# Altium schematic sheet Calculator.SchDoc
size 457 x 342 mm
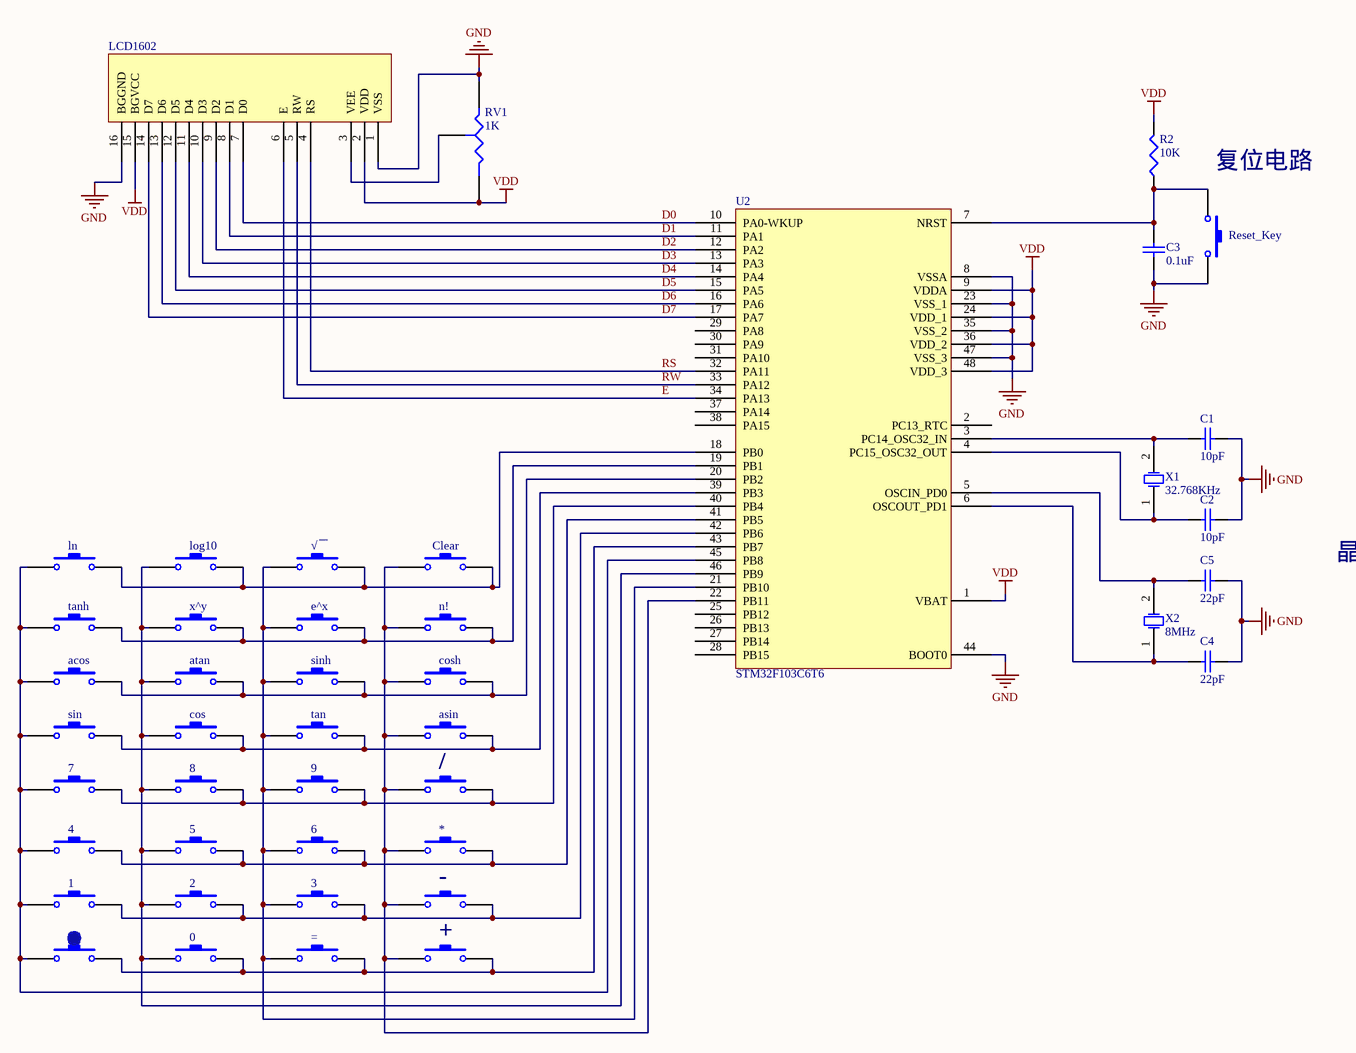
[diagram p0: Calculator.SchDoc]

## Parts
0  SW-PB  [SPST-2]  (value not drawn)
1  SW-PB  [SPST-2]  (value not drawn)
2  SW-PB  [SPST-2]  (value not drawn)
3  SW-PB  [SPST-2]  (value not drawn)
4  SW-PB  [SPST-2]  (value not drawn)
5  SW-PB  [SPST-2]  (value not drawn)
6  SW-PB  [SPST-2]  (value not drawn)
7  SW-PB  [SPST-2]  (value not drawn)
8  SW-PB  [SPST-2]  (value not drawn)
9  SW-PB  [SPST-2]  (value not drawn)
*  SW-PB  [SPST-2]  (value not drawn)
+  SW-PB  [SPST-2]  (value not drawn)
-  SW-PB  [SPST-2]  (value not drawn)
/  SW-PB  [SPST-2]  (value not drawn)
=  SW-PB  [SPST-2]  (value not drawn)
?  SW-PB  [SPST-2]  (value not drawn)
acos  SW-PB  [SPST-2]  (value not drawn)
asin  SW-PB  [SPST-2]  (value not drawn)
atan  SW-PB  [SPST-2]  (value not drawn)
C1  10pF  [RAD-0.3]
C2  10pF  [RAD-0.3]
C3  0.1uF  [RAD-0.3]
C4  22pF  [RAD-0.3]
C5  22pF  [RAD-0.3]
Clear  SW-PB  [SPST-2]  (value not drawn)
cos  SW-PB  [SPST-2]  (value not drawn)
cosh  SW-PB  [SPST-2]  (value not drawn)
e^x  SW-PB  [SPST-2]  (value not drawn)
LCD1602  LCD1602  (value not drawn)
ln  SW-PB  [SPST-2]  (value not drawn)
log10  SW-PB  [SPST-2]  (value not drawn)
n!  SW-PB  [SPST-2]  (value not drawn)
R2  10K  [12Z-2010]
Reset_Key  SW-PB  [SPST-2]  (value not drawn)
RV1  1K  [VR3]
sin  SW-PB  [SPST-2]  (value not drawn)
sinh  SW-PB  [SPST-2]  (value not drawn)
tan  SW-PB  [SPST-2]  (value not drawn)
tanh  SW-PB  [SPST-2]  (value not drawn)
U2  STM32F103C6T6
X1  32.768KHz  [R38]
X2  8MHz  [R38]
x^y  SW-PB  [SPST-2]  (value not drawn)
√￣  SW-PB  [SPST-2]  (value not drawn)

## Nets
GND: C1.1 C2.1 C3.1 C4.1 C5.1 LCD1602.1(VSS) LCD1602.16(BGGND) Reset_Key.2 RV1.1(A) U2.8(VSSA) U2.23(VSS_1) U2.35(VSS_2) U2.44(BOOT0) U2.47(VSS_3)
VDD: LCD1602.2(VDD) LCD1602.15(BGVCC) R2.2 RV1.2(B) U2.1(VBAT) U2.9(VDDA) U2.24(VDD_1) U2.36(VDD_2) U2.48(VDD_3)
D0: LCD1602.7(D0) U2.10(PA0-WKUP)
D1: LCD1602.8(D1) U2.11(PA1)
D2: LCD1602.9(D2) U2.12(PA2)
D3: LCD1602.10(D3) U2.13(PA3)
D4: LCD1602.11(D4) U2.14(PA4)
D5: LCD1602.12(D5) U2.15(PA5)
D6: LCD1602.13(D6) U2.16(PA6)
D7: LCD1602.14(D7) U2.17(PA7)
E: LCD1602.6(E) U2.34(PA13)
RS: LCD1602.4(RS) U2.32(PA11)
RW: LCD1602.5(RW) U2.33(PA12)
Net0_1: 0.1 2.1 5.1 8.1 atan.1 cos.1 log10.1 U2.46(PB9) x^y.1
Net0_2: 0.2 +.2 =.2 ?.2 U2.43(PB7)
Net1_1: 1.1 4.1 7.1 ?.1 acos.1 ln.1 sin.1 tanh.1 U2.45(PB8)
Net1_2: 1.2 2.2 3.2 -.2 U2.42(PB6)
Net3_1: 3.1 6.1 9.1 =.1 e^x.1 sinh.1 tan.1 U2.21(PB10) √￣.1
Net4_2: 4.2 5.2 6.2 *.2 U2.41(PB5)
Net7_2: 7.2 8.2 9.2 /.2 U2.40(PB4)
Net*_1: *.1 +.1 -.1 /.1 asin.1 Clear.1 cosh.1 n!.1 U2.22(PB11)
Netacos_2: acos.2 atan.2 cosh.2 sinh.2 U2.20(PB2)
Netasin_2: asin.2 cos.2 sin.2 tan.2 U2.39(PB3)
NetC1_2: C1.2 U2.3(PC14_OSC32_IN) X1.2(OSC2)
NetC2_2: C2.2 U2.4(PC15_OSC32_OUT) X1.1(OSC1)
NetC3_2: C3.2 R2.1 Reset_Key.1 U2.7(NRST)
NetC4_2: C4.2 U2.6(OSCOUT_PD1) X2.1(OSC1)
NetC5_2: C5.2 U2.5(OSCIN_PD0) X2.2(OSC2)
NetClear_2: Clear.2 ln.2 log10.2 U2.18(PB0) √￣.2
Nete^x_2: e^x.2 n!.2 tanh.2 U2.19(PB1) x^y.2
NetLCD1602_3: LCD1602.3(VEE) RV1.3(TAP)

Not connected (* = marked no-connect by the designer): U2 2(PC13_RTC) 25(PB12) 26(PB13) 27(PB14) 28(PB15) 29(PA8) 30(PA9) 31(PA10) 37(PA14) 38(PA15)

## Notes on the sheet
- 复位电路
- 晶振电路
- 项目名称：
- 文件名称：
- 淘宝搜索店铺：字节智控
- 字节智控
- 设计人：
- 核对人：
- 日期：
- 批准：
- 版本：
- 第
- 页
- 共
- 淘宝店铺：字节智控
- https://zijiezhikong.taobao.com

## Library data of the parts
0-9 * + - / = ? acos asin atan Clear cos cosh e^x ln log10 n! Reset_Key sin sinh tan tanh x^y √￣ = SW-PB: Switch; Published: 24-Mar-1999; LatestRevisionDate: 17-Jul-2002; LatestRevisionNote: Re-released for DXP Platform.; PackageReference: SPST-2; Publisher: Altium Limited; PackageDescription: Switch; 2 Leads
C1-C5 = Cap: Capacitor; Value: 100pF; Published: 8-Jun-2000; LatestRevisionDate: 17-Jul-2002; LatestRevisionNote: Re-released for DXP Platform.; PackageReference: RAD-0.3; Publisher: Altium Limited; PackageDescription: Radial Cap, Thru-Hole; 2 Leads; 0.3 in Pin Spacing
R2 = Res3: Resistor; Value: 1K; Published: 8-Jun-2000; LatestRevisionDate: 29-May-2009; LatestRevisionNote: IPC-7351 Footprint Added.; PackageReference: J1-0603; Publisher: Altium Limited; PackageDescription: Chip Resistor
RV1 = Res Tap: Tapped Resistor; Sim Note: Enter the Resistance value and the set point into parameter fields.; Set Position: 0.5; Published: 24-Mar-1999; LatestRevisionDate: 17-Jul-2002; LatestRevisionNote: Re-released for DXP Platform.; PackageReference: VR3; Publisher: Altium Limited; PackageDescription: Variable Resistor, Thru-Hole; 3 Leads; Value: 1K
X1 X2 = XTAL: Crystal Oscillator; Published: 8-Jun-2000; LatestRevisionDate: 17-Jul-2002; LatestRevisionNote: Re-released for DXP Platform.; PackageReference: R38; Publisher: Altium Limited; PackageDescription: Crystal, Thru-Hole; 2 Leads; Body 3.1 x 8.2 mm (Dia.xH)